# EAGLE schematic slice (EAGLE 5.10)

## Sheet 1 of 3
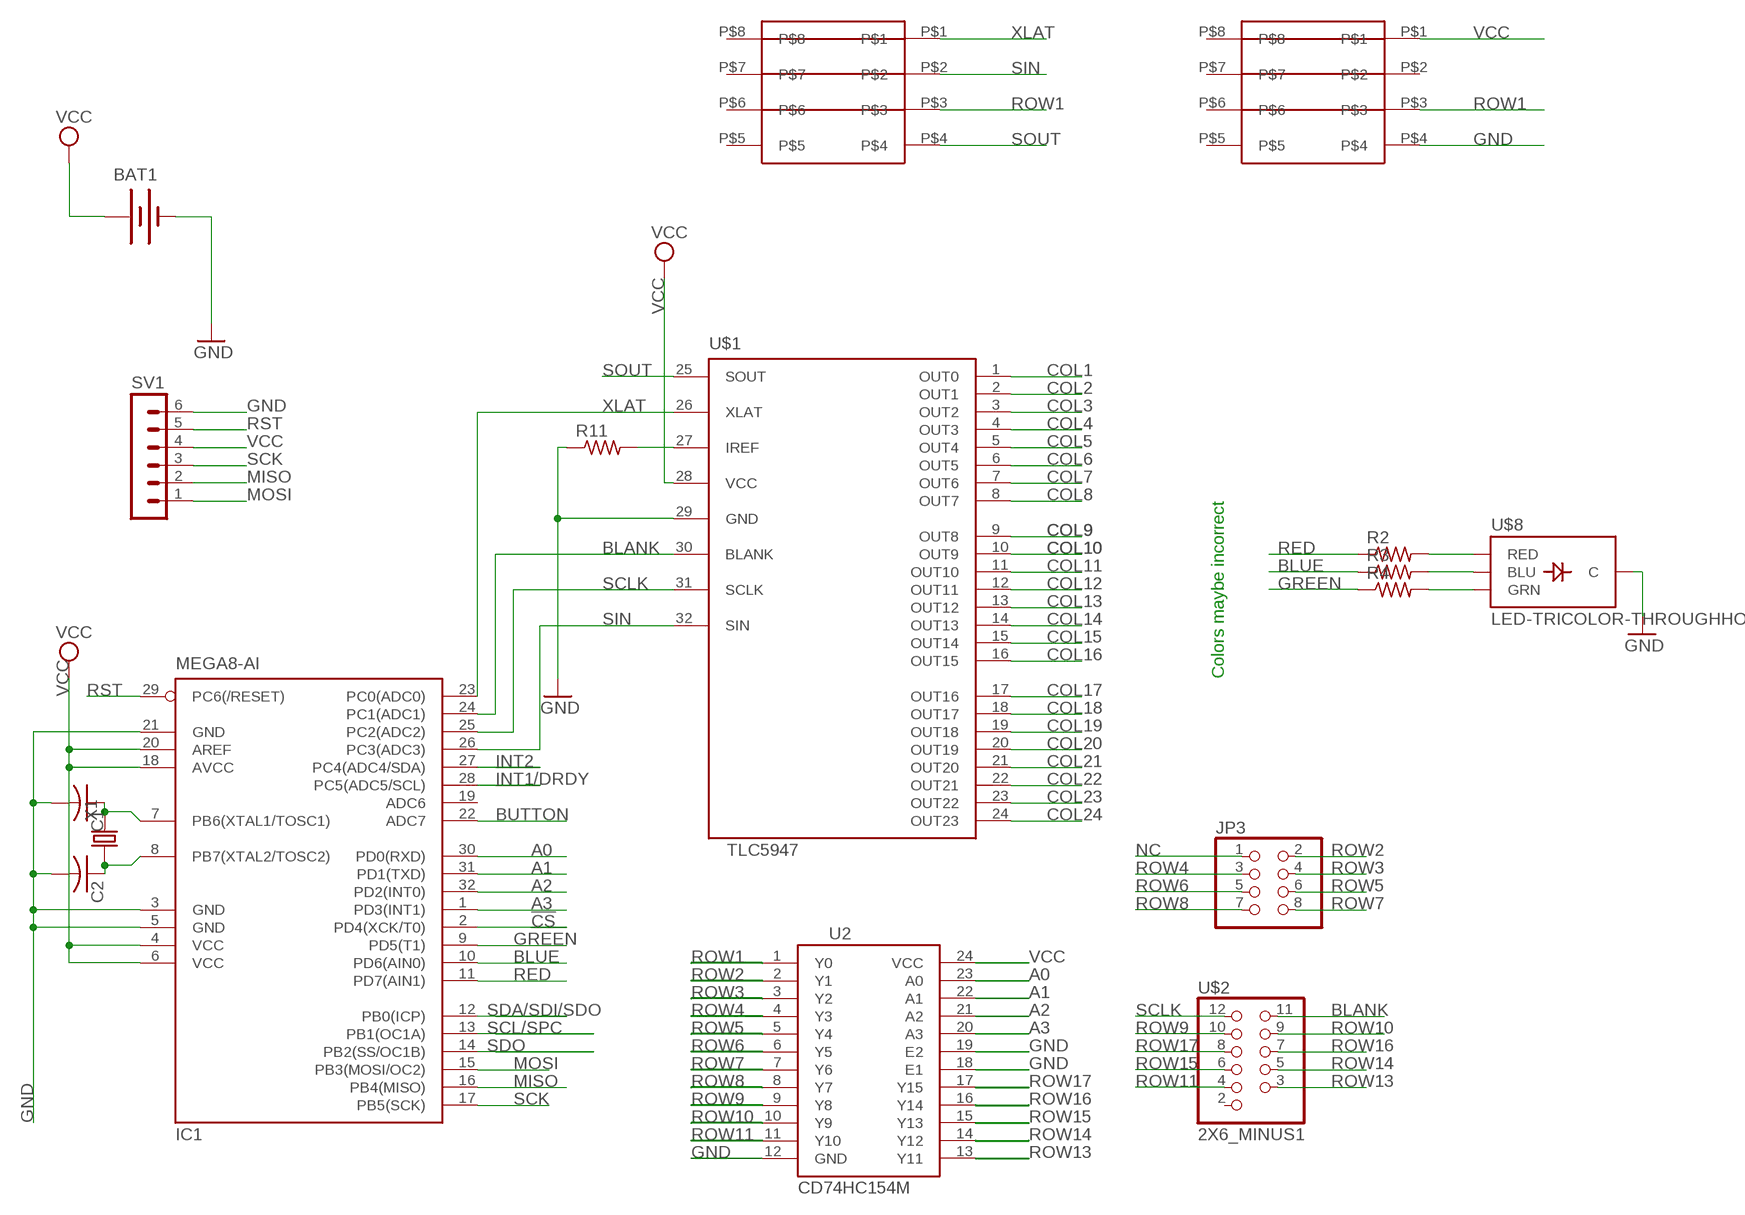
[diagram p0: schematic, sheet 1]

### Parts
BAT1  BATTERY20SMD  [BATTCON_20MM]
C1  C-USC0805  [C0805]
C2  C-USC0805  [C0805]
IC1  MEGA8-AI  [TQFP32-08]
JP3  PINHD-2X4/90  [2X04/90]
R2  R-US_M0805  [M0805]
R3  R-US_M0805  [M0805]
R4  R-US_M0805  [M0805]
R11  R-US_R0805  [R0805]
SV1  MA06-1  [MA06-1]
U2  CD74HC154M  [SO-24DW]
U$1  TLC5947  [QFN32]
U$2  2X6_MINUS1  [2X6_MINUS1]
U$4  EDGE_SLICE  [SLICE_EDGE]
U$8  LED-TRICOLOR-THROUGHHOLE  [LED-TRICOLOR-THROUGHHOLE]
U$9  EDGE_SLICE  [SLICE_EDGE]
X1  CRYSTAL-5032  [5032]

### Nets
!CS: IC1.2(PD4(XCK/T0)) ; also sheet 3
A0: IC1.30(PD0(RXD)) U2.23(A0)
A1: IC1.31(PD1(TXD)) U2.22(A1)
A2: IC1.32(PD2(INT0)) U2.21(A2)
A3: IC1.1(PD3(INT1)) U2.20(A3)
BLANK: IC1.24(PC1(ADC1)) U$1.30(BLANK) U$2.11
BLUE: IC1.10(PD6(AIN0)) R3.1
BUTTON: IC1.22(ADC7) ; also sheet 3
COL1: U$1.1(OUT0) ; also sheet 2
COL2: U$1.2(OUT1) ; also sheet 2
COL3: U$1.3(OUT2) ; also sheet 2
COL4: U$1.4(OUT3) ; also sheet 2
COL5: U$1.5(OUT4) ; also sheet 2
COL6: U$1.6(OUT5) ; also sheet 2
COL7: U$1.7(OUT6) ; also sheet 2
COL8: U$1.8(OUT7) ; also sheet 2
COL9: U$1.9(OUT8) ; also sheet 2
COL10: U$1.10(OUT9) ; also sheet 2
COL11: U$1.11(OUT10) ; also sheet 2
COL12: U$1.12(OUT11) ; also sheet 2
COL13: U$1.13(OUT12) ; also sheet 2
COL14: U$1.14(OUT13) ; also sheet 2
COL15: U$1.15(OUT14) ; also sheet 2
COL16: U$1.16(OUT15) ; also sheet 2
COL17: U$1.17(OUT16) ; also sheet 2
COL18: U$1.18(OUT17) ; also sheet 2
COL19: U$1.19(OUT18) ; also sheet 2
COL20: U$1.20(OUT19) ; also sheet 2
COL21: U$1.21(OUT20) ; also sheet 2
COL22: U$1.22(OUT21) ; also sheet 2
COL23: U$1.23(OUT22) ; also sheet 2
COL24: U$1.24(OUT23) ; also sheet 2
GND: BAT1.2(-) C1.2 C2.2 IC1.3(GND) IC1.5(GND) IC1.21(GND) R11.1 SV1.6 U2.12(GND) U2.18(E1) U2.19(E2) U$1.29(GND) U$8.GND(C) U$9.P$4 ; also sheet 3
GREEN: IC1.9(PD5(T1)) R4.1
INT1/DRDY: IC1.28(PC5(ADC5/SCL)) ; also sheet 3
INT2: IC1.27(PC4(ADC4/SDA)) ; also sheet 3
MISO: IC1.16(PB4(MISO)) SV1.2
MOSI: IC1.15(PB3(MOSI/OC2)) SV1.1
N$3: R2.2 U$8.RED
N$4: R3.2 U$8.BLU
N$6: R4.2 U$8.GRN
N$7: C1.1 IC1.7(PB6(XTAL1/TOSC1)) X1.2
N$8: C2.1 IC1.8(PB7(XTAL2/TOSC2)) X1.1
N$13: R11.2 U$1.27(IREF)
NC: JP3.1
RED: IC1.11(PD7(AIN1)) R2.1
ROW1: U2.1(Y0) U$4.P$3 U$9.P$3 ; also sheet 2
ROW2: JP3.2 U2.2(Y1)
ROW3: JP3.4 U2.3(Y2)
ROW4: JP3.3 U2.4(Y3)
ROW5: JP3.6 U2.5(Y4)
ROW6: JP3.5 U2.6(Y5)
ROW7: JP3.8 U2.7(Y6)
ROW8: JP3.7 U2.8(Y7)
ROW9: U2.9(Y8) U$2.10
ROW10: U2.10(Y9) U$2.9
ROW11: U2.11(Y10) U$2.4
ROW13: U2.13(Y11) U$2.3
ROW14: U2.14(Y12) U$2.5
ROW15: U2.15(Y13) U$2.6
ROW16: U2.16(Y14) U$2.7
ROW17: U2.17(Y15) U$2.8
RST: IC1.29(PC6(/RESET)) SV1.5
SCK: IC1.17(PB5(SCK)) SV1.3
SCL/SPC: IC1.13(PB1(OC1A)) ; also sheet 3
SCLK: IC1.25(PC2(ADC2)) U$1.31(SCLK) U$2.12
SDA/SDI/SDO: IC1.12(PB0(ICP)) ; also sheet 3
SDO: IC1.14(PB2(SS/OC1B)) ; also sheet 3
SIN: IC1.26(PC3(ADC3)) U$1.32(SIN) U$4.P$2
SOUT: U$1.25(SOUT) U$4.P$4
VCC: BAT1.1(+) IC1.4(VCC) IC1.6(VCC) IC1.18(AVCC) IC1.20(AREF) SV1.4 U2.24(VCC) U$1.28(VCC) U$9.P$1 ; also sheet 2,3
XLAT: IC1.23(PC0(ADC0)) U$1.26(XLAT) U$4.P$1
Unconnected: IC1.19(ADC6) U$2.2 U$4.P$5 U$4.P$6 U$4.P$7 U$4.P$8 U$9.P$2 U$9.P$5 U$9.P$6 U$9.P$7 U$9.P$8

### Notes on the sheet
- Colors maybe incorrect

## Sheet 2 of 3
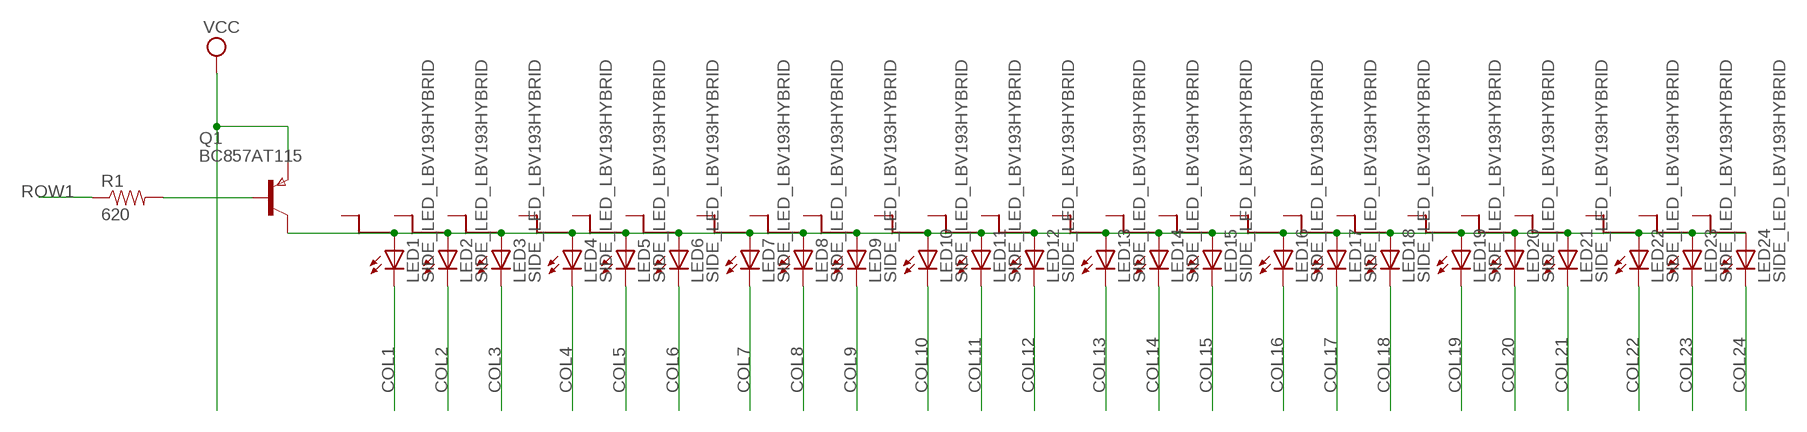
[diagram p1: schematic, sheet 2]

### Parts
LED1  SIDE_LED_LBV193HYBRID  [LED_SIDE_LB192_HYBRID]
LED2  SIDE_LED_LBV193HYBRID  [LED_SIDE_LB192_HYBRID]
LED3  SIDE_LED_LBV193HYBRID  [LED_SIDE_LB192_HYBRID]
LED4  SIDE_LED_LBV193HYBRID  [LED_SIDE_LB192_HYBRID]
LED5  SIDE_LED_LBV193HYBRID  [LED_SIDE_LB192_HYBRID]
LED6  SIDE_LED_LBV193HYBRID  [LED_SIDE_LB192_HYBRID]
LED7  SIDE_LED_LBV193HYBRID  [LED_SIDE_LB192_HYBRID]
LED8  SIDE_LED_LBV193HYBRID  [LED_SIDE_LB192_HYBRID]
LED9  SIDE_LED_LBV193HYBRID  [LED_SIDE_LB192_HYBRID]
LED10  SIDE_LED_LBV193HYBRID  [LED_SIDE_LB192_HYBRID]
LED11  SIDE_LED_LBV193HYBRID  [LED_SIDE_LB192_HYBRID]
LED12  SIDE_LED_LBV193HYBRID  [LED_SIDE_LB192_HYBRID]
LED13  SIDE_LED_LBV193HYBRID  [LED_SIDE_LB192_HYBRID]
LED14  SIDE_LED_LBV193HYBRID  [LED_SIDE_LB192_HYBRID]
LED15  SIDE_LED_LBV193HYBRID  [LED_SIDE_LB192_HYBRID]
LED16  SIDE_LED_LBV193HYBRID  [LED_SIDE_LB192_HYBRID]
LED17  SIDE_LED_LBV193HYBRID  [LED_SIDE_LB192_HYBRID]
LED18  SIDE_LED_LBV193HYBRID  [LED_SIDE_LB192_HYBRID]
LED19  SIDE_LED_LBV193HYBRID  [LED_SIDE_LB192_HYBRID]
LED20  SIDE_LED_LBV193HYBRID  [LED_SIDE_LB192_HYBRID]
LED21  SIDE_LED_LBV193HYBRID  [LED_SIDE_LB192_HYBRID]
LED22  SIDE_LED_LBV193HYBRID  [LED_SIDE_LB192_HYBRID]
LED23  SIDE_LED_LBV193HYBRID  [LED_SIDE_LB192_HYBRID]
LED24  SIDE_LED_LBV193HYBRID  [LED_SIDE_LB192_HYBRID]
Q1  BC857AT115  PNPSOT323SOT416  [SOT416]
R1  620  SPARKFUN_RESISTOR0603-RES  [SPARKFUN_0603-RES]

### Nets
COL1: LED1.2(C) ; also sheet 1
COL2: LED2.2(C) ; also sheet 1
COL3: LED3.2(C) ; also sheet 1
COL4: LED4.2(C) ; also sheet 1
COL5: LED5.2(C) ; also sheet 1
COL6: LED6.2(C) ; also sheet 1
COL7: LED7.2(C) ; also sheet 1
COL8: LED8.2(C) ; also sheet 1
COL9: LED9.2(C) ; also sheet 1
COL10: LED10.2(C) ; also sheet 1
COL11: LED11.2(C) ; also sheet 1
COL12: LED12.2(C) ; also sheet 1
COL13: LED13.2(C) ; also sheet 1
COL14: LED14.2(C) ; also sheet 1
COL15: LED15.2(C) ; also sheet 1
COL16: LED16.2(C) ; also sheet 1
COL17: LED17.2(C) ; also sheet 1
COL18: LED18.2(C) ; also sheet 1
COL19: LED19.2(C) ; also sheet 1
COL20: LED20.2(C) ; also sheet 1
COL21: LED21.2(C) ; also sheet 1
COL22: LED22.2(C) ; also sheet 1
COL23: LED23.2(C) ; also sheet 1
COL24: LED24.2(C) ; also sheet 1
LINE1: LED1.1(A) LED2.1(A) LED3.1(A) LED4.1(A) LED5.1(A) LED6.1(A) LED7.1(A) LED8.1(A) LED9.1(A) LED10.1(A) LED11.1(A) LED12.1(A) LED13.1(A) LED14.1(A) LED15.1(A) LED16.1(A) LED17.1(A) LED18.1(A) LED19.1(A) LED20.1(A) LED21.1(A) LED22.1(A) LED23.1(A) LED24.1(A) Q1.1(C)
N$2: Q1.2(B) R1.2
ROW1: R1.1 ; also sheet 1
VCC: Q1.3(E) ; also sheet 1,3
Unconnected: LED1.3(E) LED1.4(F) LED2.3(E) LED2.4(F) LED3.3(E) LED3.4(F) LED4.3(E) LED4.4(F) LED5.3(E) LED5.4(F) LED6.3(E) LED6.4(F) LED7.3(E) LED7.4(F) LED8.3(E) LED8.4(F) LED9.3(E) LED9.4(F) LED10.3(E) LED10.4(F) LED11.3(E) LED11.4(F) LED12.3(E) LED12.4(F) LED13.3(E) LED13.4(F) LED14.3(E) LED14.4(F) LED15.3(E) LED15.4(F) LED16.3(E) LED16.4(F) LED17.3(E) LED17.4(F) LED18.3(E) LED18.4(F) LED19.3(E) LED19.4(F) LED20.3(E) LED20.4(F) LED21.3(E) LED21.4(F) LED22.3(E) LED22.4(F) LED23.3(E) LED23.4(F) LED24.3(E) LED24.4(F)

## Sheet 3 of 3
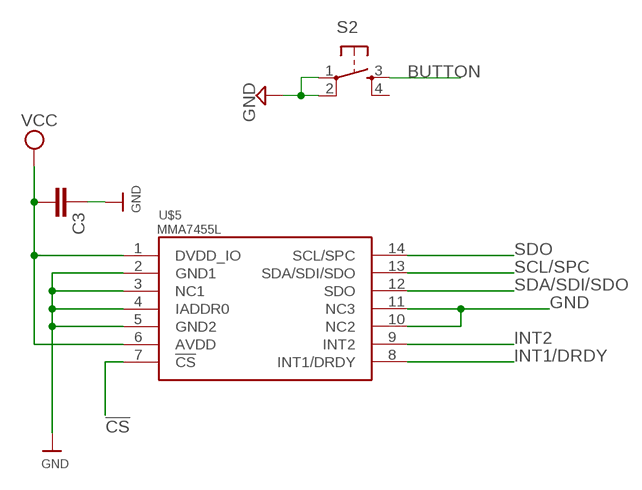
[diagram p2: schematic, sheet 3]

### Parts
C3  CAP0805  [0805]
S2  TAC_SWITCHSMD  [TACTILE_SWITCH_SMD]
U$5  MMA7455L  [LGA-14]

### Nets
!CS: U$5.7(!CS) ; also sheet 1
BUTTON: S2.3 ; also sheet 1
GND: C3.1 S2.1 S2.2 U$5.2(GND1) U$5.3(NC1) U$5.4(IADDR0) U$5.5(GND2) U$5.10(NC2) U$5.11(NC3) ; also sheet 1
INT1/DRDY: U$5.8(INT1/DRDY) ; also sheet 1
INT2: U$5.9(INT2) ; also sheet 1
SCL/SPC: U$5.13(SDA/SDI/SDO) ; also sheet 1
SDA/SDI/SDO: U$5.12(SDO) ; also sheet 1
SDO: U$5.14(SCL/SPC) ; also sheet 1
VCC: C3.2 U$5.1(DVDD_IO) U$5.6(AVDD) ; also sheet 1,2
Unconnected: S2.4

## Library data of the parts
BAT1 = SparkFun:BATTERY: Battery Holders Various common sizes : AA, AAA, 20mm coin cell and 12mm coin cell.
C1 C2 = rcl:C-US: CAPACITOR, American symbol
C3 = SparkFun:CAP: Capacitor Standard 0603 ceramic capacitor, and 0.1" leaded capacitor.
IC1 = atmel:MEGA8: MICROCONTROLLER 8 Kbytes FLASH, 1 kbytes SRAM, 512 bytes EEPROM, USART, 6-channel 10 bit ADC, 2-channel 8 bit ADC Pin compatible with Atmega48, ATMega88, ATMega168 Source: avr.lbr; MPN: ATMEGA8-16AU; OC_FARNELL: 9171371; OC_NEWARK: 73M8863
JP3 = pinhead:PINHD-2X4: PIN HEADER
LED1-LED24 = slice:SIDE_LED_LBV193
Q1 = zetex:PNPSOT323: PNP TRANSISTOR
R1 = Nullspace:SPARKFUN_RESISTOR: Resistor Basic schematic elements and footprints for 0603, 1206, and PTH 1/10th watt (small) resistors.
R2-R4 = slice:R-US_: RESISTOR, American symbol
R11 = rcl:R-US_: RESISTOR, American symbol
S2 = SparkFun:TAC_SWITCH: Momentary Switch Button commonly used for reset or general input. Spark Fun Electronics SKU : COM-00097
SV1 = NSL:MA06-1: PIN HEADER
U2 = SparkFun:CD74HC154M: High-Speed CMOS Logic 4- to 16-Line Decoder/Demultiplexer
U$1 = lil_rgb:TLC5947
U$2 = slice:2X6_MINUS1
U$4 U$9 = slice:EDGE_SLICE
U$5 = MMA7455Lbreakoutboard-v1a:MMA7455L
U$8 = SparkFun:LED-TRICOLOR-THROUGHHOLE
X1 = NSL_MiniQuad:CRYSTAL*: CRYSTAL

## Net classes
0 default: width 0.254 mm